# Altium schematic sheet 1_MIAN.schdoc
size 431 x 309 mm; Symbol: Sheet-Symbol_A3; Device: Sheet-Symbol_A3; @Page Name: MIAN; @Create Date: 2023-12-22; @Page Count: 3; @Page No: 1; @Project Name: DDS; @Schematic Name: DDS_1; @Update Date: 2023-12-27; Company: 嘉立创EDA; Page Size: A3; Version: V1.0
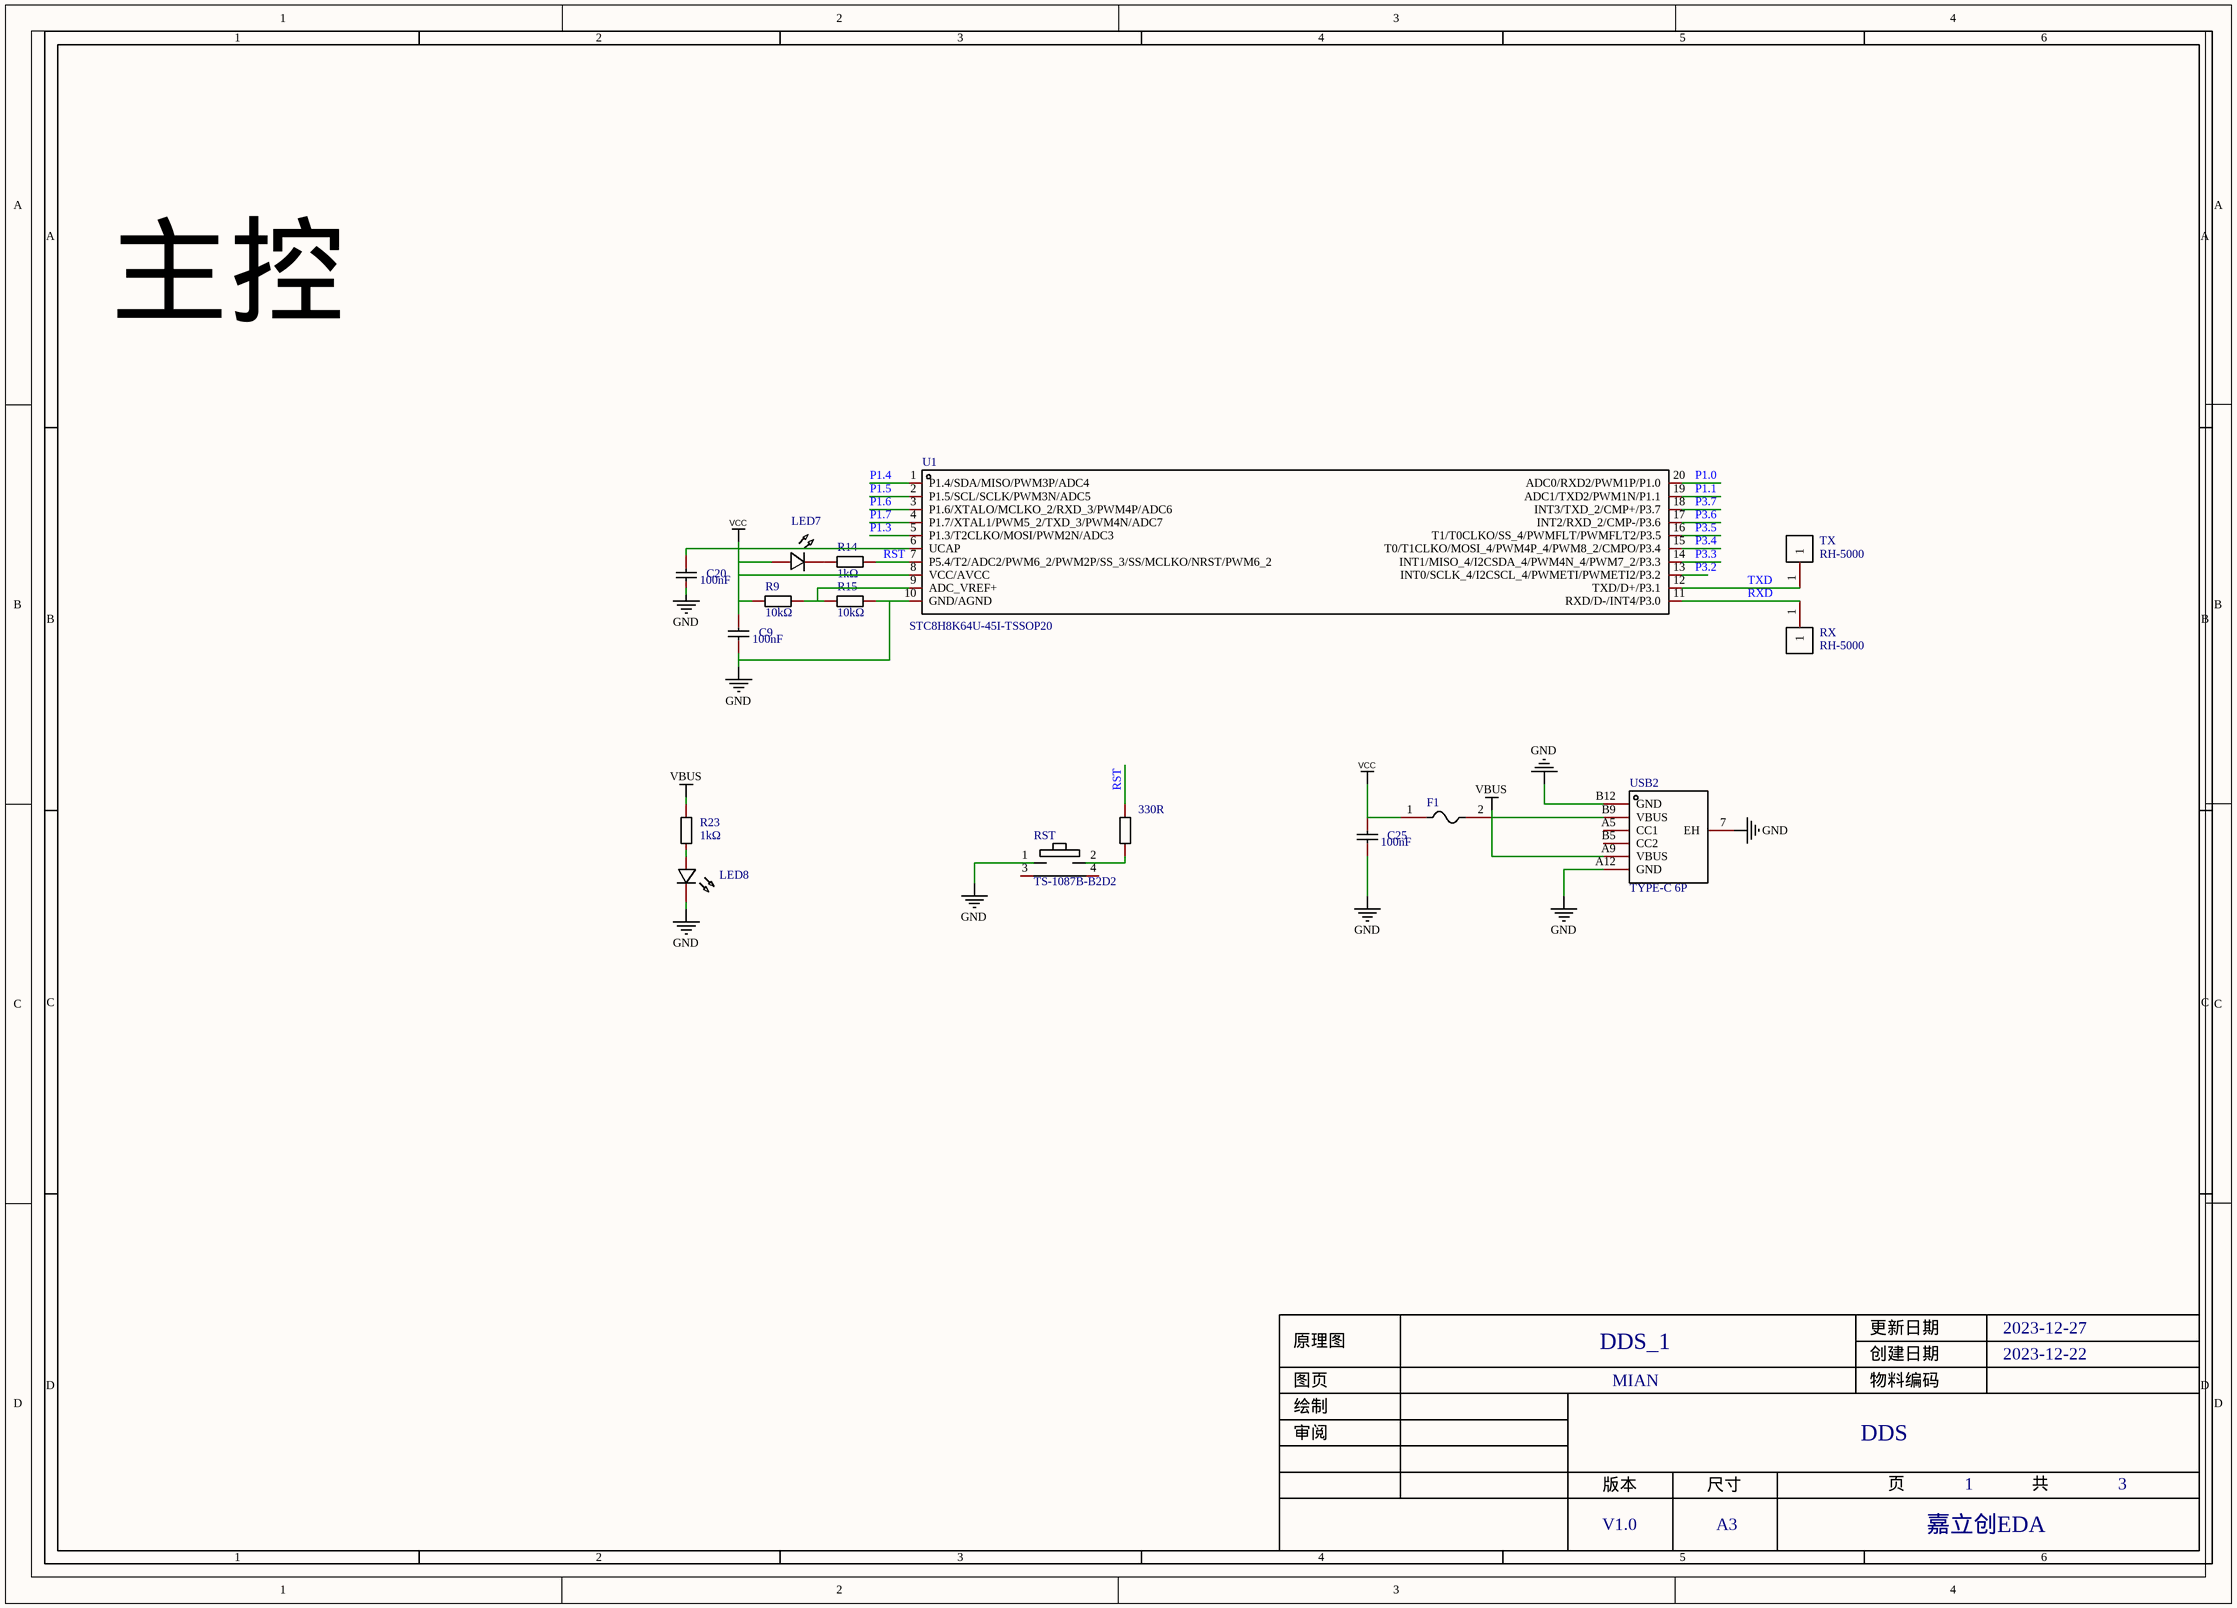
[diagram p0: 1_MIAN.schdoc]

## Parts
C9  100nF  [C0805]
C20  100nF  [C0805]
C25  100nF  [C0805]
F1  nSMD010  [F1206]  (value not drawn)
LED7  LED_B  [LED_0805]  (value not drawn)
LED8  LED_B  [LED_0805]  (value not drawn)
R5  330R  [R0805]
R9  10kΩ  [R0805]
R14  1kΩ  [R0805]
R15  10kΩ  [R0805]
R23  1kΩ  [R0805]
RST  TS-1087B-B2D2  [KEY-SMD_4P-L7.8-W2.8-P4.20-EH]
RX  RH-5000  [TEST-TH_BD2.54-P1.4_RED]
TX  RH-5000  [TEST-TH_BD2.54-P1.4_RED]
U1  STC8H8K64U-45I-TSSOP20  [TSSOP-20_L6.5-W4.4-P0.65-LS6.5-BL]
USB2  TYPE-C 6P  [TYPE-C-SMD_TYPE-C-6P]

## Nets
GND: C9.1 C20.1 C25.1 LED8.1(C) R15.2 RST.1 U1.10(GND/AGND) USB2.7(EH) USB2.A12(GND) USB2.B12(GND)
VBUS: F1.2 R23.2 USB2.A9(VBUS) USB2.B9(VBUS)
VCC: C9.2 C25.2 F1.1 LED7.2(A) R9.1 U1.8(VCC/AVCC)
P1.0: U1.20(ADC0/RXD2/PWM1P/P1.0)
P1.1: U1.19(ADC1/TXD2/PWM1N/P1.1)
P1.3: U1.5(P1.3/T2CLKO/MOSI/PWM2N/ADC3)
P1.4: U1.1(P1.4/SDA/MISO/PWM3P/ADC4)
P1.5: U1.2(P1.5/SCL/SCLK/PWM3N/ADC5)
P1.6: U1.3(P1.6/XTALO/MCLKO_2/RXD_3/PWM4P/ADC6)
P1.7: U1.4(P1.7/XTAL1/PWM5_2/TXD_3/PWM4N/ADC7)
P3.2: U1.13(INT0/SCLK_4/I2CSCL_4/PWMETI/PWMETI2/P3.2)
P3.3: U1.14(INT1/MISO_4/I2CSDA_4/PWM4N_4/PWM7_2/P3.3)
P3.4: U1.15(T0/T1CLKO/MOSI_4/PWM4P_4/PWM8_2/CMPO/P3.4)
P3.5: U1.16(T1/T0CLKO/SS_4/PWMFLT/PWMFLT2/P3.5)
P3.6: U1.17(INT2/RXD_2/CMP-/P3.6)
P3.7: U1.18(INT3/TXD_2/CMP+/P3.7)
RST: R5.2 R14.2 U1.7(P5.4/T2/ADC2/PWM6_2/PWM2P/SS_3/SS/MCLKO/NRST/PWM6_2)
RXD: RX.1 U1.11(RXD/D-/INT4/P3.0)
TXD: TX.1 U1.12(TXD/D+/P3.1)
NetC20_2: C20.2 U1.6(UCAP)
NetLED7_1: LED7.1(C) R14.1
NetLED8_2: LED8.2(A) R23.1
NetR5_1: R5.1 RST.2
NetR9_2: R9.2 R15.1 U1.9(ADC_VREF+)

Not connected (* = marked no-connect by the designer): RST 3 4; USB2 A5(CC1) B5(CC2)

## Notes on the sheet
- 主控
- 1
- 2
- 3
- 4
- 5
- 6
- A
- B
- C
- 原理图
- DDS_1
- 创建日期
- 更新日期
- 2023-12-22
- 2023-12-27
- D
- 审阅
- 绘制
- 图页
- MIAN
- 物料编码
- DDS
- 版本
- 尺寸
- 页
- 共
- V1.0
- A3
- 嘉立创EDA

## Library data of the parts
C9 C20 C25 = 0805B104K500NT: 容值:100nF;精度:±10%;额定电压:50V;材质(温度系数):X7R;; Manufacturer: FH(风华); Add into BOM: yes; Tolerance: ±10%; Voltage Rated: 50V; Temperature Coefficient: X7R; Name: 100nF; Symbol: 0805B104K500NT; Device: 0805B104K500NT; LCSC Part Name: 100nF ±10% 50V; Supplier Part: C38141; Manufacturer Part: 0805B104K500NT; Supplier Footprint: 0805; Datasheet: https://atta.szlcsc.com/upload/public/pdf/source/20200305/C486355_26A10D38EF8C2A5C37091D0039909270.pdf; Supplier: LCSC; Convert to PCB: yes; Value: 100nF
F1 = nSMD010: 最大电压:60V;最大电流:40A;保持电流:100mA;跳闸电流:250mA;; Manufacturer: 台湾陆海; Add into BOM: yes; Operating Voltage (Max): 60V; Current Rating (Max): 40A; Hold Current: 100mA; Trip Current: 250mA; Power Dissipation: -；-；-；-; Name: nSMD010; Symbol: nSMD010; Device: nSMD010; LCSC Part Name: 0.10A 60V 自恢复保险丝; Supplier Part: C70065; Manufacturer Part: nSMD010; Supplier Footprint: 1206; Datasheet: https://atta.szlcsc.com/upload/public/pdf/source/20230404/ADB19886462D98F83AD677B1F8114E76.pdf; Supplier: LCSC; Convert to PCB: yes; Operating Temperature: -40℃~+85℃
LED7 LED8 = LED_B: Convert to PCB: yes; Symbol: LED_B; Device: LED_B; Add into BOM: yes; Supplier Footprint: 0805
R5 R9 R14 R15 R23 = 0805W8F1001T5E: 阻值:1kΩ;精度:±1%;功率:125mW;温度系数:±100ppm/℃;电阻类型:厚膜电阻;; Manufacturer: UNI-ROYAL(厚声); Add into BOM: yes; Tolerance: ±1%; Power(Watts): 125mW; Overload Voltage (Max): 150V; Symbol: 0805W8F1001T5E; Device: 0805W8F1001T5E; LCSC Part Name: 1kΩ ±1% 125mW 厚膜电阻; Supplier Part: C17513; Manufacturer Part: 0805W8F1001T5E; Supplier Footprint: 0805; Datasheet: https://atta.szlcsc.com/upload/public/pdf/source/20200306/C422600_1E6D84923E4A46A82E41ADD87F860B5C.pdf; Supplier: LCSC; Convert to PCB: yes; Temperature Coefficient: ±100ppm/℃; Type: 厚膜电阻; Operating Temperature Range: -55℃~+155℃
  R5: Name: 330R; Value: 330R
  R9 R15: Name: 10kΩ; Value: 10kΩ
  R14 R23: Name: 1kΩ; Value: 1kΩ
RST = TS-1087B-B2D2: 电路结构:单刀单掷;按钮作用方向:侧面触动;致动器样式:矩形按钮;照明颜色:-;作用力:180gf ±30gf;开关高度:3.5mm;; Manufacturer: Yuandi(元迪); Add into BOM: yes; Circuit: 单刀单掷; Actuator Orientation: 侧面触动; Actuator Style: 矩形按钮; Switch Height: 3.5mm; Name: TS-1087B-B2D2; Symbol: TS-1087B-B2D2; Device: TS-1087B-B2D2; LCSC Part Name: 轻触开关7.0*2.3*3.5有柱黑柄侧按侧贴180gf; Supplier Part: C498303; Manufacturer Part: TS-1087B-B2D2; Supplier Footprint: -; Datasheet: https://atta.szlcsc.com/upload/public/pdf/source/20200318/C498302_5CF788D07D014771B0E800D7BCB3EFA7.pdf; Supplier: LCSC; Convert to PCB: yes; Illumination Color: -; Operating Force: 180gf ±30gf
RX TX = RH-5000: 100x80mm; Manufacturer: 荣和; Add into BOM: yes; Name: RH-5000; Symbol: RH-5000; Device: RH-5000; LCSC Part Name: PCB电路板测试点/测试针; Supplier Part: C5277086; Manufacturer Part: RH-5000; Supplier Footprint: -; Datasheet: https://atta.szlcsc.com/upload/public/pdf/source/20230704/1671C2774A3D6CEDC1FD6AAF48538C87.pdf; Supplier: LCSC; Convert to PCB: yes
U1 = STC8H8K64U-45I-TSSOP20: Manufacturer: STC(宏晶); Add into BOM: yes; Name: STC8H8K64U-45I-TSSOP20; Symbol: STC8H8K64U-45I-TSSOP20; Device: STC8H8K64U-45I-TSSOP20; LCSC Part Name: STC8H8K64U-45I-TSSOP20; Supplier Part: C5210758; Manufacturer Part: STC8H8K64U-45I-TSSOP20; Supplier Footprint: TSSOP-20; Datasheet: https://atta.szlcsc.com/upload/public/pdf/source/20230914/FE7F6A67FEB4E2D9A560A799C5B97078.pdf; Supplier: LCSC; Convert to PCB: yes
USB2 = TYPE-C 6P: 连接器类型:Type-C;标准:-;公母:母;端口数量:1;触点数量:6P;安装方式:卧贴;额定电流 - 电源:-;工作温度范围:-40℃~+85℃;; Manufacturer: SHOU HAN(首韩); Add into BOM: yes; Gender: 母; Number of Ports: 1; Name: TYPE-C 6P; Symbol: TYPE-C 6P; Device: TYPE-C 6P; LCSC Part Name: Type-C 母 卧贴; Supplier Part: C456012; Manufacturer Part: TYPE-C 6P; Supplier Footprint: SMD; Datasheet: https://atta.szlcsc.com/upload/public/pdf/source/20201203/C456012_B13F72044DF846EDBE9BDD0D1D3CD166.pdf; Supplier: LCSC; Convert to PCB: yes; Connector Type: Type-C; Standard: -; Number of Contacts: 6P; Mounting Style: 卧贴; Current Rating - Power (Max): -; Operating Temperature Range: -40℃~+85℃